# EasyEDA Pro project 3.3VBuck_MP2225_P1.epro

# Schematic 3.3VBuck_MP2225
Board Name: Board1; Create Date: 2024-12-15; Page Name: 3.3VBuck_MP2225_P1; Project Name: 3.3VBuck_MP2225; Schematic Name: 3.3VBuck_MP2225; Update Date: 2024-12-16; Company: 嘉立创EDA; Page Size: A4; Version: V1.0
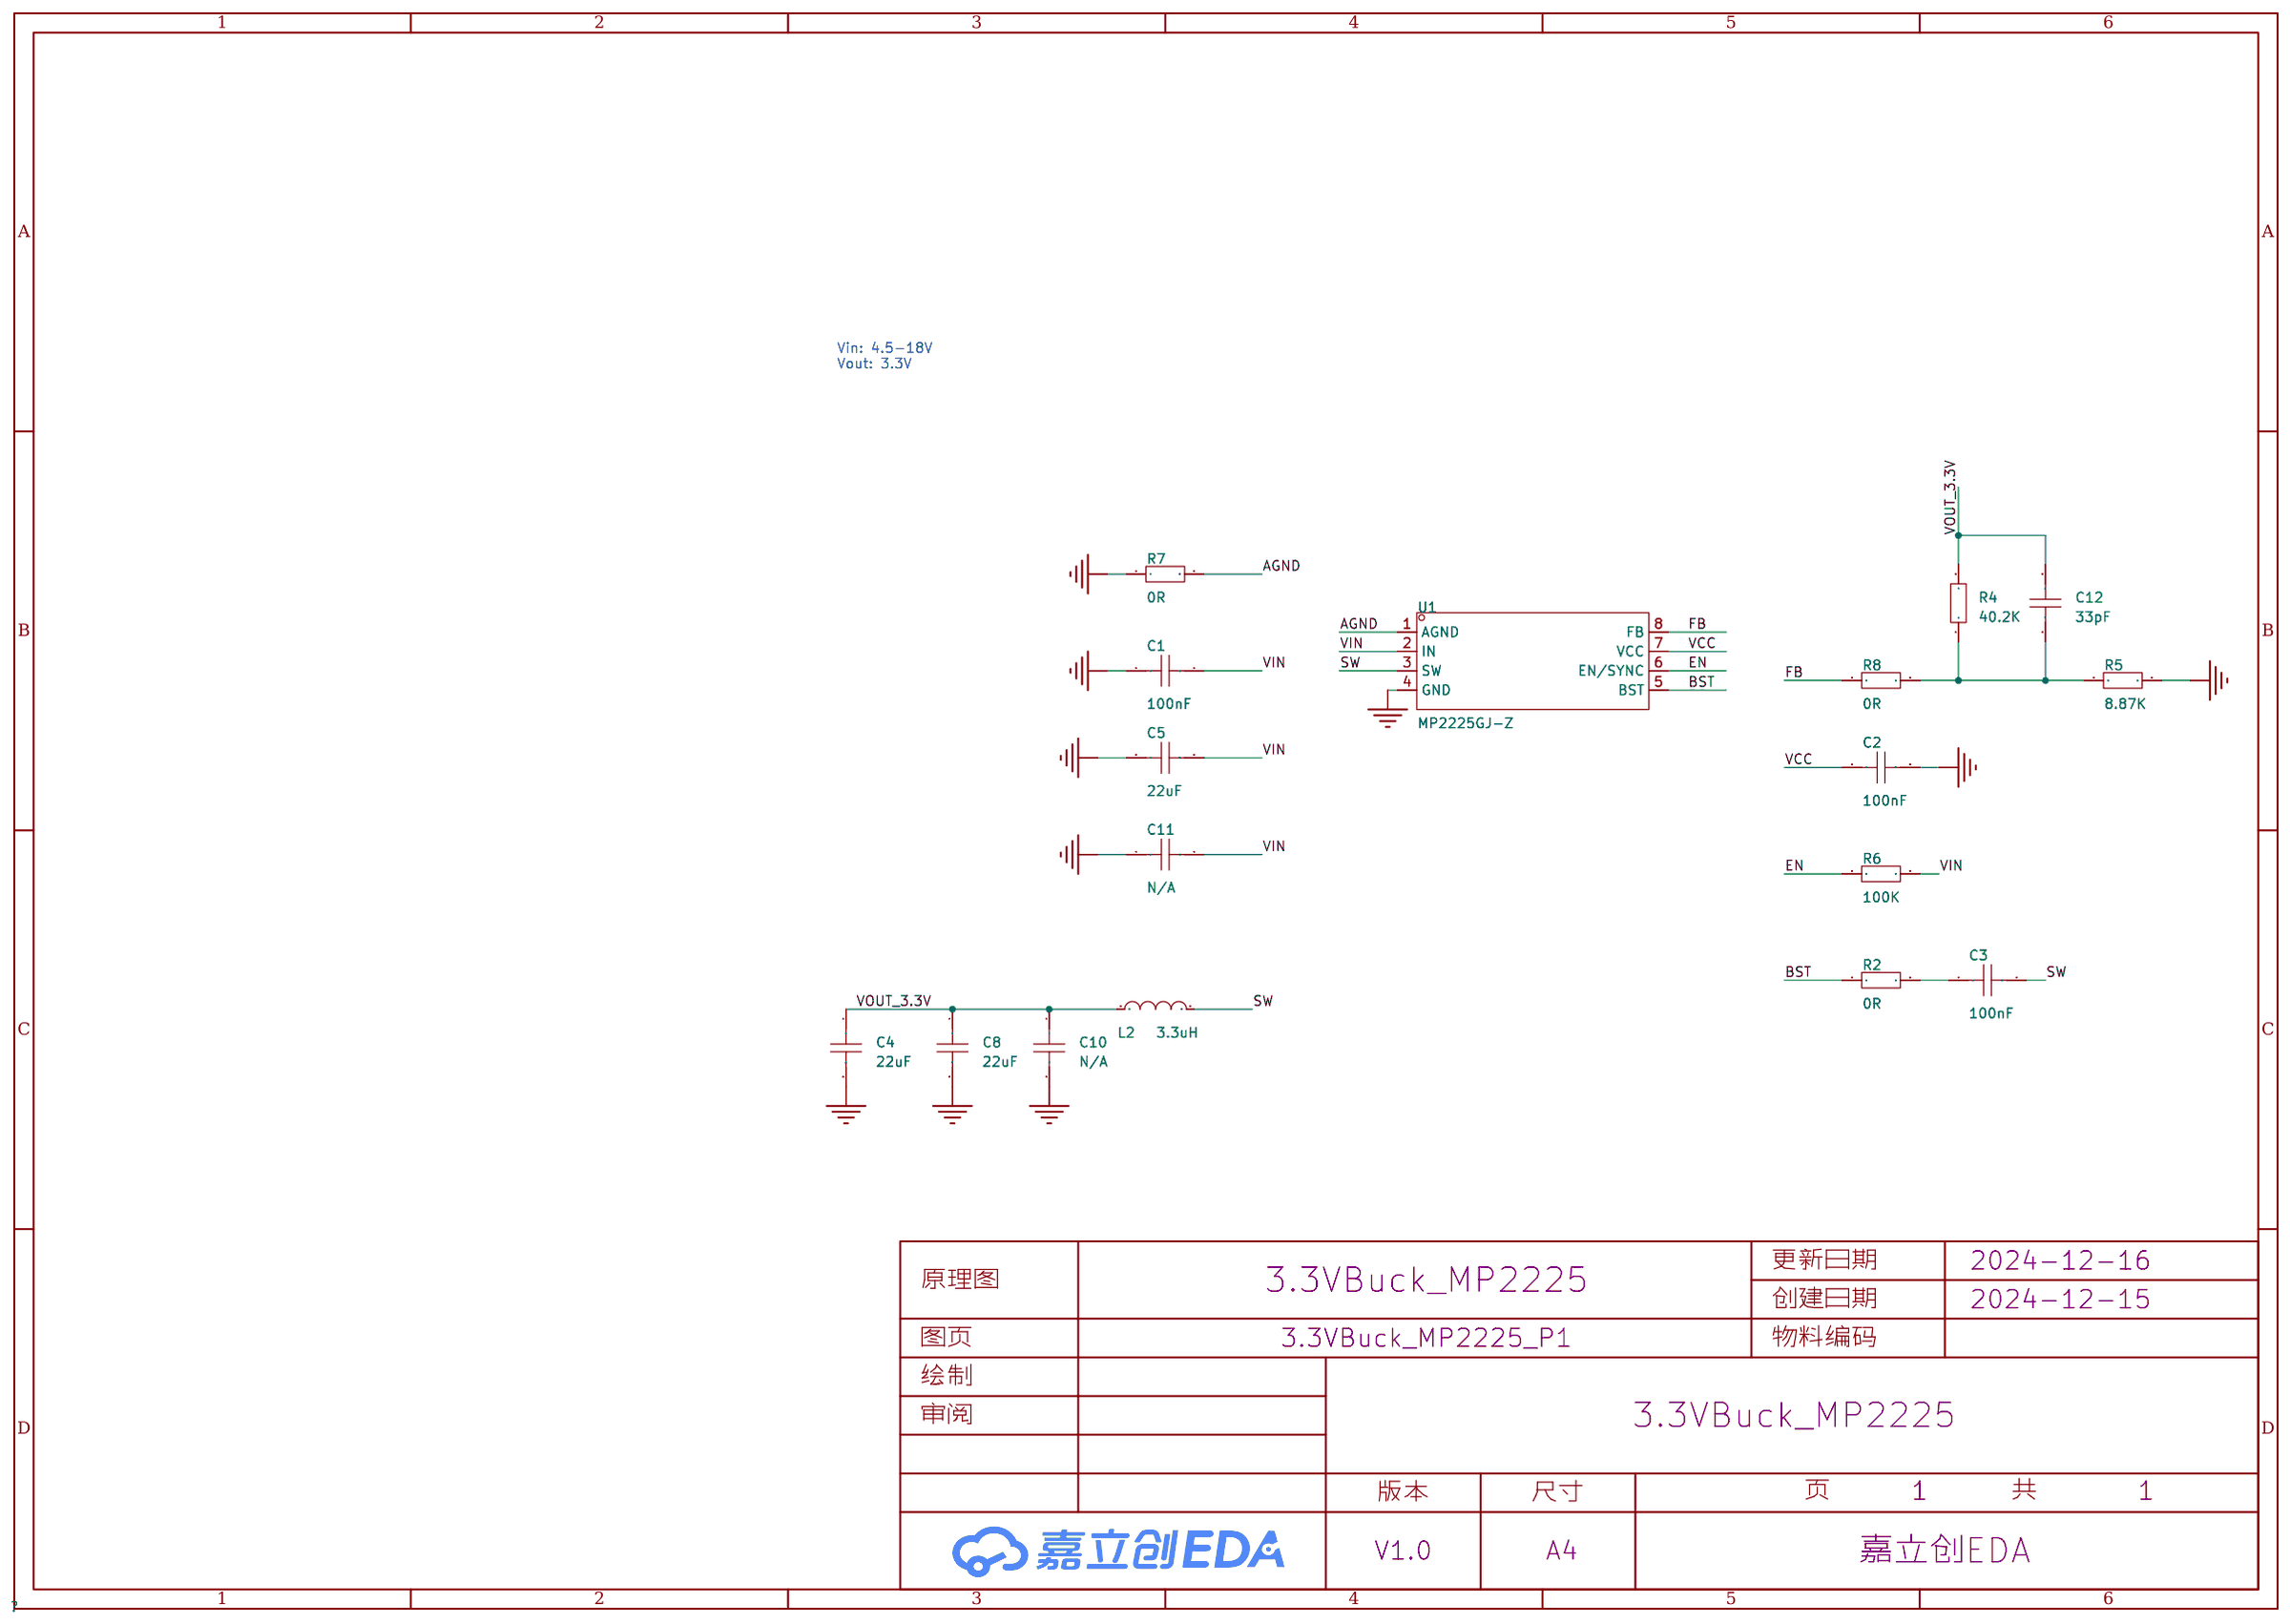
[diagram p0: schematic sheet]

## Parts
C1  100nF  [C0805]
C2  100nF  [C0805]
C3  100nF  [C0805]
C4  22uF  [C0805]
C5  22uF  [C0805]
C8  22uF  [C0805]
C10  N/A  [C0805]
C11  N/A  [C0805]
C12  33pF  [C0805]
L2  3.3uH  [IND-SMD_L7.1-W6.6_MJC-0603T]
R2  0R  [R0805]
R4  40.2K  [R0805]
R5  8.87K  [R0805]
R6  100K  [R0805]
R7  0R  [R0805]
R8  0R  [R0805]
U1  MP2225GJ-Z  [TSOT-23-8_L2.9-W1.6-P0.65-LS2.8-BR]

## Library data of the parts
C1-C5 C8 C10-C12 = CAP_0805: Supplier Footprint: 0805
L2 = CXP0630-5R6M-AG(5.6uh): 电感值:5.6uH;精度:±20%;额定电流:5.5A;饱和电流(Isat):7A;类型:一体成型电感;; LCSC Part Name: 5.6uH ±20% 7A; Supplier Part: C7461360; Manufacturer: DMBJ(振宝佳); Supplier Footprint: 0630; Datasheet: https://atta.szlcsc.com/upload/public/pdf/source/20230706/7F3A5B39C5AD80A91C9FA782B54A296B.pdf; Supplier: LCSC; Tolerance: ±20%; Rated Current: 5.5A; Saturation Current (Isat): 7A; DC Resistance (DCR): 42mΩ; Type: 一体成型电感
R2 R4-R8 = Res_0805: Supplier Footprint: 0805
U1 = MP2225GJ-Z_C133066: 功能类型:降压型;输出类型:可调;输入电压:4.5V~18V;输出电压:600mV~18V;输出电流:5A;; LCSC Part Name: 高效率5A 18V同步降压转换器; Supplier Part: C133066; Manufacturer: MPS(芯源); Supplier Footprint: TSOT-23-8; JLCPCB Part Class: 扩展库; Datasheet: https://atta.szlcsc.com/upload/public/pdf/source/20240315/DE01001F1E5BE5D21C887012CE3070B7.pdf; Supplier: LCSC; Function: 降压型; Output Type: 可调; Input Voltage: 4.5V~18V; Output Voltage: 600mV~18V; Output Current: 5A; Switching Frequency: 500kHz; Operating Temperature: -40℃~+125℃; Synchronous Rectification: 是; Number of Outputs: 1; Topology: 降压式; Quiescent Current (Iq): 400uA; Switch tube (built-in/external): 内置

## Nets
AGND: R7.2 U1.1(AGND)
GND: C1.1 C2.2 C4.2 C5.1 C8.2 C10.2 C11.1 R5.2 R7.1 U1.4(GND)
VCC: C2.1 U1.7(VCC)
VIN: C1.2 C5.2 C11.2 R6.1 U1.2(IN)
BST: R2.1 U1.5(BST)
EN: R6.2 U1.6(EN/SYNC)
FB: R8.1 U1.8(FB)
SW: C3.2 L2.2 U1.3(SW)
VOUT_3.3V: C4.1 C8.1 C10.1 C12.2 L2.1 R4.2
Net-(C3-1): C3.1 R2.2
Net-(C12-1): C12.1 R4.1 R5.1 R8.2

## Notes on the sheet
- Vin: 4.5-18V
  Vout: 3.3V
